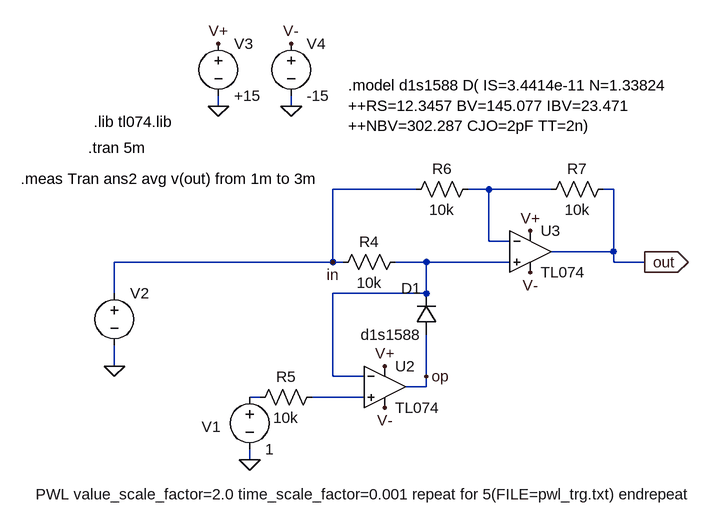
[diagram p0: schematic fig27P0-1VtrigF1k.asc]
fig27P0-1VtrigF1k.asc, the LTspice schematic file:
Version 4
SHEET 1 1200 680
WIRE 112 -96 112 -112
WIRE 224 -96 224 -112
WIRE 416 32 288 32
WIRE 528 32 496 32
WIRE 624 32 528 32
WIRE 720 32 704 32
WIRE 528 112 528 32
WIRE 560 112 528 112
WIRE 720 128 720 32
WIRE 720 128 624 128
WIRE 288 144 288 32
WIRE 288 144 -48 144
WIRE 304 144 288 144
WIRE 432 144 384 144
WIRE 560 144 432 144
WIRE 720 144 720 128
WIRE 768 144 720 144
WIRE -48 192 -48 144
WIRE 432 192 432 144
WIRE 432 192 288 192
WIRE -48 304 -48 272
WIRE 288 320 288 192
WIRE 336 320 288 320
WIRE 432 320 432 256
WIRE 432 336 432 320
WIRE 432 336 400 336
WIRE 176 352 160 352
WIRE 336 352 256 352
WIRE 160 448 160 432
FLAG -48 304 0
FLAG 160 448 0
FLAG 768 144 out
IOPIN 768 144 Out
FLAG 112 -96 0
FLAG 224 -96 0
FLAG 112 -192 V+
FLAG 224 -192 V-
FLAG 288 144 in
FLAG 368 304 V+
FLAG 368 368 V-
FLAG 432 320 op
FLAG 592 96 V+
FLAG 592 160 V-
SYMBOL res 288 160 R270
WINDOW 0 32 56 VTop 0
WINDOW 3 0 56 VBottom 0
SYMATTR InstName R4
SYMATTR Value 10k
SYMBOL voltage -48 176 R0
WINDOW 123 0 0 Left 0
WINDOW 39 0 0 Left 0
WINDOW 3 -121 325 Left 0
SYMATTR Value PWL value_scale_factor=2.0 time_scale_factor=0.001 repeat for 5(FILE=pwl_trg.txt) endrepeat
SYMATTR InstName V2
SYMBOL diode 448 256 R180
WINDOW 0 24 72 Left 0
WINDOW 3 24 0 Left 0
SYMATTR InstName D1
SYMATTR Value d1s1588
SYMBOL voltage 112 -208 R0
SYMATTR InstName V3
SYMATTR Value +15
SYMBOL voltage 224 -208 R0
SYMATTR InstName V4
SYMATTR Value -15
SYMBOL Opamps\\opamp2 368 272 R0
SYMATTR InstName U2
SYMATTR Value TL074
SYMBOL res 160 368 R270
WINDOW 0 32 56 VTop 0
WINDOW 3 0 56 VBottom 0
SYMATTR InstName R5
SYMATTR Value 10k
SYMBOL res 400 48 R270
WINDOW 0 32 56 VTop 0
WINDOW 3 0 56 VBottom 0
SYMATTR InstName R6
SYMATTR Value 10k
SYMBOL res 608 48 R270
WINDOW 0 32 56 VTop 0
WINDOW 3 0 56 VBottom 0
SYMATTR InstName R7
SYMATTR Value 10k
SYMBOL Opamps\\opamp2 592 64 R0
SYMATTR InstName U3
SYMATTR Value TL074
SYMBOL voltage 160 336 R0
WINDOW 0 -74 61 Left 0
WINDOW 123 0 0 Left 0
WINDOW 39 0 0 Left 0
SYMATTR InstName V1
SYMATTR Value 1
TEXT -80 -72 Left 0 !.lib tl074.lib
TEXT -88 -32 Left 0 !.tran 5m
TEXT -192 16 Left 0 !.meas Tran ans2 avg v(out) from 1m to 3m
TEXT 312 -128 Left 0 !.model d1s1588 D( IS=3.4414e-11 N=1.33824 \n++RS=12.3457 BV=145.077 IBV=23.471 \n++NBV=302.287 CJO=2pF TT=2n)

The netlist it stands for:
* fig27P0-1VtrigF1k.asc
R4 in N002 10k
V2 in 0 PWL value_scale_factor=2.0 time_scale_factor=0.001 repeat for 5(FILE=pwl_trg.txt) endrepeat
D1 op N002 d1s1588
V3 V+ 0 +15
V4 V- 0 -15
XU2 N004 N002 V+ V- op TL074  ; pins In+ In- V+ V- OUT
R5 N003 N004 10k
R6 in N001 10k
R7 N001 out 10k
XU3 N002 N001 V+ V- out TL074  ; pins In+ In- V+ V- OUT
V1 N003 0 1
.model D D
.lib standard.dio
.lib tl074.lib
.tran 5m
.meas Tran ans2 avg v(out) from 1m to 3m
.model d1s1588 D( IS=3.4414e-11 N=1.33824
++RS=12.3457 BV=145.077 IBV=23.471
++NBV=302.287 CJO=2pF TT=2n)
.backanno
.end